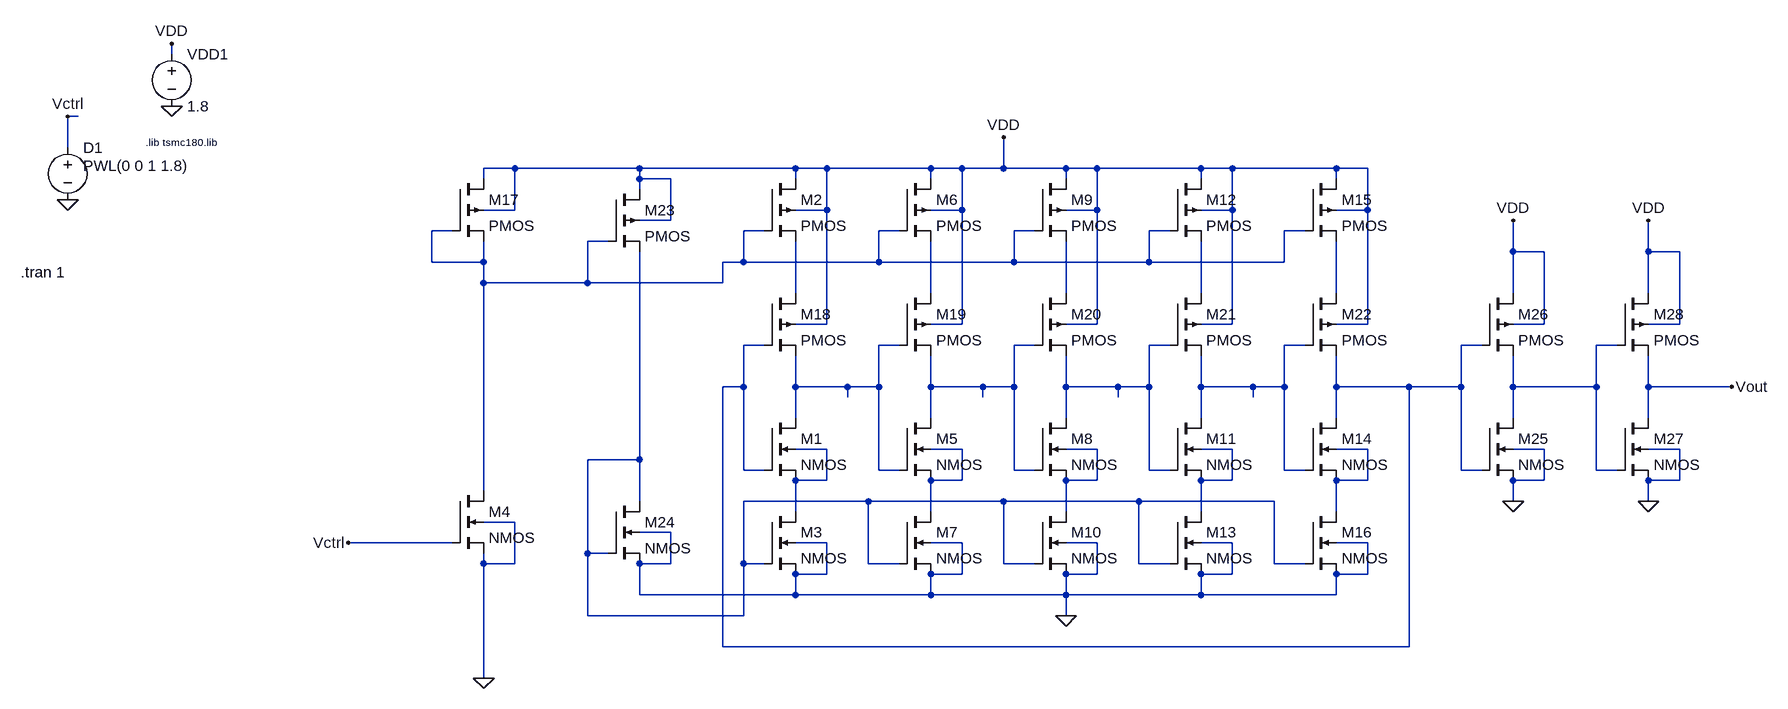
[diagram p0: schematic VCO1.asc]
VCO1.asc, the LTspice schematic file:
Version 4
SHEET 1 1560 692
WIRE -912 -416 -912 -432
WIRE -1056 -320 -1072 -320
WIRE -1072 -272 -1072 -320
WIRE -384 -240 -432 -240
WIRE -192 -240 -384 -240
WIRE 48 -240 -192 -240
WIRE 96 -240 48 -240
WIRE 256 -240 96 -240
WIRE 304 -240 256 -240
WIRE 368 -240 368 -288
WIRE 368 -240 304 -240
WIRE 464 -240 368 -240
WIRE 512 -240 464 -240
WIRE 672 -240 512 -240
WIRE 720 -240 672 -240
WIRE 880 -240 720 -240
WIRE 928 -240 880 -240
WIRE -432 -224 -432 -240
WIRE -192 -224 -192 -240
WIRE -144 -224 -192 -224
WIRE 48 -224 48 -240
WIRE 256 -224 256 -240
WIRE 464 -224 464 -240
WIRE 672 -224 672 -240
WIRE 880 -224 880 -240
WIRE -192 -208 -192 -224
WIRE -384 -176 -384 -240
WIRE -384 -176 -432 -176
WIRE 96 -176 96 -240
WIRE 96 -176 48 -176
WIRE 304 -176 304 -240
WIRE 304 -176 256 -176
WIRE 512 -176 512 -240
WIRE 512 -176 464 -176
WIRE 720 -176 720 -240
WIRE 720 -176 672 -176
WIRE 928 -176 928 -240
WIRE 928 -176 880 -176
WIRE -144 -160 -144 -224
WIRE -144 -160 -192 -160
WIRE -480 -144 -512 -144
WIRE 0 -144 -32 -144
WIRE 208 -144 176 -144
WIRE 416 -144 384 -144
WIRE 624 -144 592 -144
WIRE 832 -144 800 -144
WIRE -240 -128 -272 -128
WIRE 1152 -112 1152 -160
WIRE 1200 -112 1152 -112
WIRE 1360 -112 1360 -160
WIRE 1408 -112 1360 -112
WIRE -512 -96 -512 -144
WIRE -432 -96 -432 -128
WIRE -432 -96 -512 -96
WIRE -32 -96 -32 -144
WIRE -32 -96 -64 -96
WIRE 176 -96 176 -144
WIRE 176 -96 -32 -96
WIRE 384 -96 384 -144
WIRE 384 -96 176 -96
WIRE 592 -96 592 -144
WIRE 592 -96 384 -96
WIRE 800 -96 800 -144
WIRE 800 -96 592 -96
WIRE -432 -64 -432 -96
WIRE -272 -64 -272 -128
WIRE -272 -64 -432 -64
WIRE -64 -64 -64 -96
WIRE -64 -64 -272 -64
WIRE 48 -48 48 -128
WIRE 256 -48 256 -128
WIRE 464 -48 464 -128
WIRE 672 -48 672 -128
WIRE 880 -48 880 -128
WIRE 1152 -48 1152 -112
WIRE 1360 -48 1360 -112
WIRE 96 0 96 -176
WIRE 96 0 48 0
WIRE 304 0 304 -176
WIRE 304 0 256 0
WIRE 512 0 512 -176
WIRE 512 0 464 0
WIRE 720 0 720 -176
WIRE 720 0 672 0
WIRE 928 0 928 -176
WIRE 928 0 880 0
WIRE 1200 0 1200 -112
WIRE 1200 0 1152 0
WIRE 1408 0 1408 -112
WIRE 1408 0 1360 0
WIRE 0 32 -32 32
WIRE 208 32 176 32
WIRE 416 32 384 32
WIRE 624 32 592 32
WIRE 832 32 800 32
WIRE 1104 32 1072 32
WIRE 1312 32 1280 32
WIRE -32 96 -32 32
WIRE -32 96 -64 96
WIRE 48 96 48 48
WIRE 128 96 48 96
WIRE 176 96 176 32
WIRE 176 96 128 96
WIRE 256 96 256 48
WIRE 336 96 256 96
WIRE 384 96 384 32
WIRE 384 96 336 96
WIRE 464 96 464 48
WIRE 544 96 464 96
WIRE 592 96 592 32
WIRE 592 96 544 96
WIRE 672 96 672 48
WIRE 752 96 672 96
WIRE 800 96 800 32
WIRE 800 96 752 96
WIRE 880 96 880 48
WIRE 992 96 880 96
WIRE 1072 96 1072 32
WIRE 1072 96 992 96
WIRE 1152 96 1152 48
WIRE 1280 96 1280 32
WIRE 1280 96 1152 96
WIRE 1360 96 1360 48
WIRE 1488 96 1360 96
WIRE 128 112 128 96
WIRE 336 112 336 96
WIRE 544 112 544 96
WIRE 752 112 752 96
WIRE 48 144 48 96
WIRE 256 144 256 96
WIRE 464 144 464 96
WIRE 672 144 672 96
WIRE 880 144 880 96
WIRE 1152 144 1152 96
WIRE 1360 144 1360 96
WIRE 96 192 48 192
WIRE 304 192 256 192
WIRE 512 192 464 192
WIRE 720 192 672 192
WIRE 928 192 880 192
WIRE 1200 192 1152 192
WIRE 1408 192 1360 192
WIRE -192 208 -192 -112
WIRE -192 208 -272 208
WIRE -32 224 -32 96
WIRE 0 224 -32 224
WIRE 176 224 176 96
WIRE 208 224 176 224
WIRE 384 224 384 96
WIRE 416 224 384 224
WIRE 592 224 592 96
WIRE 624 224 592 224
WIRE 800 224 800 96
WIRE 832 224 800 224
WIRE 1072 224 1072 96
WIRE 1104 224 1072 224
WIRE 1280 224 1280 96
WIRE 1312 224 1280 224
WIRE 96 240 96 192
WIRE 96 240 48 240
WIRE 304 240 304 192
WIRE 304 240 256 240
WIRE 512 240 512 192
WIRE 512 240 464 240
WIRE 720 240 720 192
WIRE 720 240 672 240
WIRE 928 240 928 192
WIRE 928 240 880 240
WIRE 1200 240 1200 192
WIRE 1200 240 1152 240
WIRE 1408 240 1408 192
WIRE 1408 240 1360 240
WIRE -432 256 -432 -64
WIRE -192 272 -192 208
WIRE 160 272 -32 272
WIRE 368 272 160 272
WIRE 576 272 368 272
WIRE 784 272 576 272
WIRE 1152 272 1152 240
WIRE 1360 272 1360 240
WIRE 48 288 48 240
WIRE 256 288 256 240
WIRE 464 288 464 240
WIRE 672 288 672 240
WIRE 880 288 880 240
WIRE -384 304 -432 304
WIRE -144 320 -192 320
WIRE -480 336 -640 336
WIRE 96 336 48 336
WIRE 304 336 256 336
WIRE 512 336 464 336
WIRE 720 336 672 336
WIRE 928 336 880 336
WIRE -272 352 -272 208
WIRE -240 352 -272 352
WIRE -432 368 -432 352
WIRE -384 368 -384 304
WIRE -384 368 -432 368
WIRE -144 368 -144 320
WIRE -144 368 -192 368
WIRE -32 368 -32 272
WIRE 0 368 -32 368
WIRE 160 368 160 272
WIRE 208 368 160 368
WIRE 368 368 368 272
WIRE 416 368 368 368
WIRE 576 368 576 272
WIRE 624 368 576 368
WIRE 784 368 784 272
WIRE 832 368 784 368
WIRE 96 384 96 336
WIRE 96 384 48 384
WIRE 304 384 304 336
WIRE 304 384 256 384
WIRE 512 384 512 336
WIRE 512 384 464 384
WIRE 720 384 720 336
WIRE 720 384 672 384
WIRE 928 384 928 336
WIRE 928 384 880 384
WIRE -192 416 -192 368
WIRE 48 416 48 384
WIRE 48 416 -192 416
WIRE 256 416 256 384
WIRE 256 416 48 416
WIRE 464 416 464 384
WIRE 464 416 256 416
WIRE 672 416 672 384
WIRE 672 416 464 416
WIRE 880 416 880 384
WIRE 880 416 672 416
WIRE -272 448 -272 352
WIRE -32 448 -32 368
WIRE -32 448 -272 448
WIRE 464 448 464 416
WIRE -64 496 -64 96
WIRE 992 496 992 96
WIRE 992 496 -64 496
WIRE -432 544 -432 368
FLAG -1072 -192 0
FLAG -912 -336 0
FLAG -912 -432 VDD
FLAG -1072 -320 Vctrl
FLAG 368 -288 VDD
FLAG 464 448 0
FLAG -640 336 Vctrl
FLAG 1152 272 0
FLAG 1152 -160 VDD
FLAG 1360 272 0
FLAG 1360 -160 VDD
FLAG 1488 96 Vout
FLAG -432 544 0
SYMBOL voltage -1072 -288 R0
WINDOW 123 0 0 Left 0
WINDOW 39 24 124 Left 2
WINDOW 3 24 44 Left 2
SYMATTR Value PWL(0 0 1 1.8)
SYMATTR InstName D1
SYMBOL voltage -912 -432 R0
WINDOW 123 0 0 Left 0
WINDOW 39 24 124 Left 2
SYMATTR InstName VDD1
SYMATTR Value 1.8
SYMBOL nmos4 0 144 R0
SYMATTR InstName M1
SYMATTR Value2 l=0.54u w=2.4u
SYMBOL pmos4 0 -224 R0
SYMATTR InstName M2
SYMATTR Value2 l=0.36u w=4.8u
SYMBOL nmos4 0 288 R0
SYMATTR InstName M3
SYMATTR Value2 l=0.36u w=0.96u
SYMBOL nmos4 -480 256 R0
SYMATTR InstName M4
SYMATTR Value2 l=0.9u w=96u
SYMBOL nmos4 208 144 R0
SYMATTR InstName M5
SYMATTR Value2 l=0.54u w=2.4u
SYMBOL pmos4 208 -224 R0
SYMATTR InstName M6
SYMATTR Value2 l=0.36u w=4.8u
SYMBOL nmos4 208 288 R0
SYMATTR InstName M7
SYMATTR Value2 l=0.36u w=0.96u
SYMBOL nmos4 416 144 R0
SYMATTR InstName M8
SYMATTR Value2 l=0.54u w=2.4u
SYMBOL pmos4 416 -224 R0
SYMATTR InstName M9
SYMATTR Value2 l=0.36u w=4.8u
SYMBOL nmos4 416 288 R0
SYMATTR InstName M10
SYMATTR Value2 l=0.36u w=0.96u
SYMBOL nmos4 624 144 R0
SYMATTR InstName M11
SYMATTR Value2 l=0.54u w=2.4u
SYMBOL pmos4 624 -224 R0
SYMATTR InstName M12
SYMATTR Value2 l=0.36u w=4.8u
SYMBOL nmos4 624 288 R0
SYMATTR InstName M13
SYMATTR Value2 l=0.36u w=0.96u
SYMBOL nmos4 832 144 R0
SYMATTR InstName M14
SYMATTR Value2 l=0.54u w=2.4u
SYMBOL pmos4 832 -224 R0
SYMATTR InstName M15
SYMATTR Value2 l=0.36u w=4.8u
SYMBOL nmos4 832 288 R0
SYMATTR InstName M16
SYMATTR Value2 l=0.36u w=0.96u
SYMBOL pmos4 -480 -224 R0
SYMATTR InstName M17
SYMATTR Value2 l=0.36u w=2.4u
SYMBOL pmos4 0 -48 R0
SYMATTR InstName M18
SYMATTR Value2 l=0.54u w=4.8u
SYMBOL pmos4 208 -48 R0
SYMATTR InstName M19
SYMATTR Value2 l=0.54u w=4.8u
SYMBOL pmos4 416 -48 R0
SYMATTR InstName M20
SYMATTR Value2 l=0.54u w=4.8u
SYMBOL pmos4 624 -48 R0
SYMATTR InstName M21
SYMATTR Value2 l=0.54u w=4.8u
SYMBOL pmos4 832 -48 R0
SYMATTR InstName M22
SYMATTR Value2 l=0.54u w=4.8u
SYMBOL pmos4 -240 -208 R0
SYMATTR InstName M23
SYMATTR Value2 l=0.36u w=4.8u
SYMBOL nmos4 -240 272 R0
SYMATTR InstName M24
SYMATTR Value2 l=0.36u w=0.96u
SYMBOL nmos4 1104 144 R0
SYMATTR InstName M25
SYMATTR Value2 l=180n w=1.2u
SYMBOL pmos4 1104 -48 R0
SYMATTR InstName M26
SYMATTR Value2 l=180n w=4.8u
SYMBOL nmos4 1312 144 R0
SYMATTR InstName M27
SYMATTR Value2 l=180n w=1.2u
SYMBOL pmos4 1312 -48 R0
SYMATTR InstName M28
SYMATTR Value2 l=180n w=4.8u
TEXT -1144 -80 Left 2 !.tran 1
TEXT -952 -280 Left 1 !.lib tsmc180.lib

The netlist it stands for:
* VCO1.asc
V§D1 Vctrl 0 PWL(0 0 1 1.8)
VDD1 VDD 0 1.8
M1 N008 N007 N013 N013 NMOS l=0.54u w=2.4u
M2 VDD N001 N002 VDD PMOS l=0.36u w=4.8u
M3 N013 N018 0 0 NMOS l=0.36u w=0.96u
M4 N001 Vctrl 0 0 NMOS l=0.9u w=96u
M5 N009 N008 N014 N014 NMOS l=0.54u w=2.4u
M6 VDD N001 N003 VDD PMOS l=0.36u w=4.8u
M7 N014 N018 0 0 NMOS l=0.36u w=0.96u
M8 N010 N009 N015 N015 NMOS l=0.54u w=2.4u
M9 VDD N001 N004 VDD PMOS l=0.36u w=4.8u
M10 N015 N018 0 0 NMOS l=0.36u w=0.96u
M11 N011 N010 N016 N016 NMOS l=0.54u w=2.4u
M12 VDD N001 N005 VDD PMOS l=0.36u w=4.8u
M13 N016 N018 0 0 NMOS l=0.36u w=0.96u
M14 N007 N011 N017 N017 NMOS l=0.54u w=2.4u
M15 VDD N001 N006 VDD PMOS l=0.36u w=4.8u
M16 N017 N018 0 0 NMOS l=0.36u w=0.96u
M17 VDD N001 N001 VDD PMOS l=0.36u w=2.4u
M18 N002 N007 N008 VDD PMOS l=0.54u w=4.8u
M19 N003 N008 N009 VDD PMOS l=0.54u w=4.8u
M20 N004 N009 N010 VDD PMOS l=0.54u w=4.8u
M21 N005 N010 N011 VDD PMOS l=0.54u w=4.8u
M22 N006 N011 N007 VDD PMOS l=0.54u w=4.8u
M23 VDD N001 N018 VDD PMOS l=0.36u w=4.8u
M24 N018 N018 0 0 NMOS l=0.36u w=0.96u
M25 N012 N007 0 0 NMOS l=180n w=1.2u
M26 VDD N007 N012 VDD PMOS l=180n w=4.8u
M27 Vout N012 0 0 NMOS l=180n w=1.2u
M28 VDD N012 Vout VDD PMOS l=180n w=4.8u
.model NMOS NMOS
.model PMOS PMOS
.lib standard.mos
.tran 1
.lib tsmc180.lib
.backanno
.end